# Altium schematic sheet Time Circuit Control.SchDoc
size A4; SheetNumber: 9; SheetTotal: 9
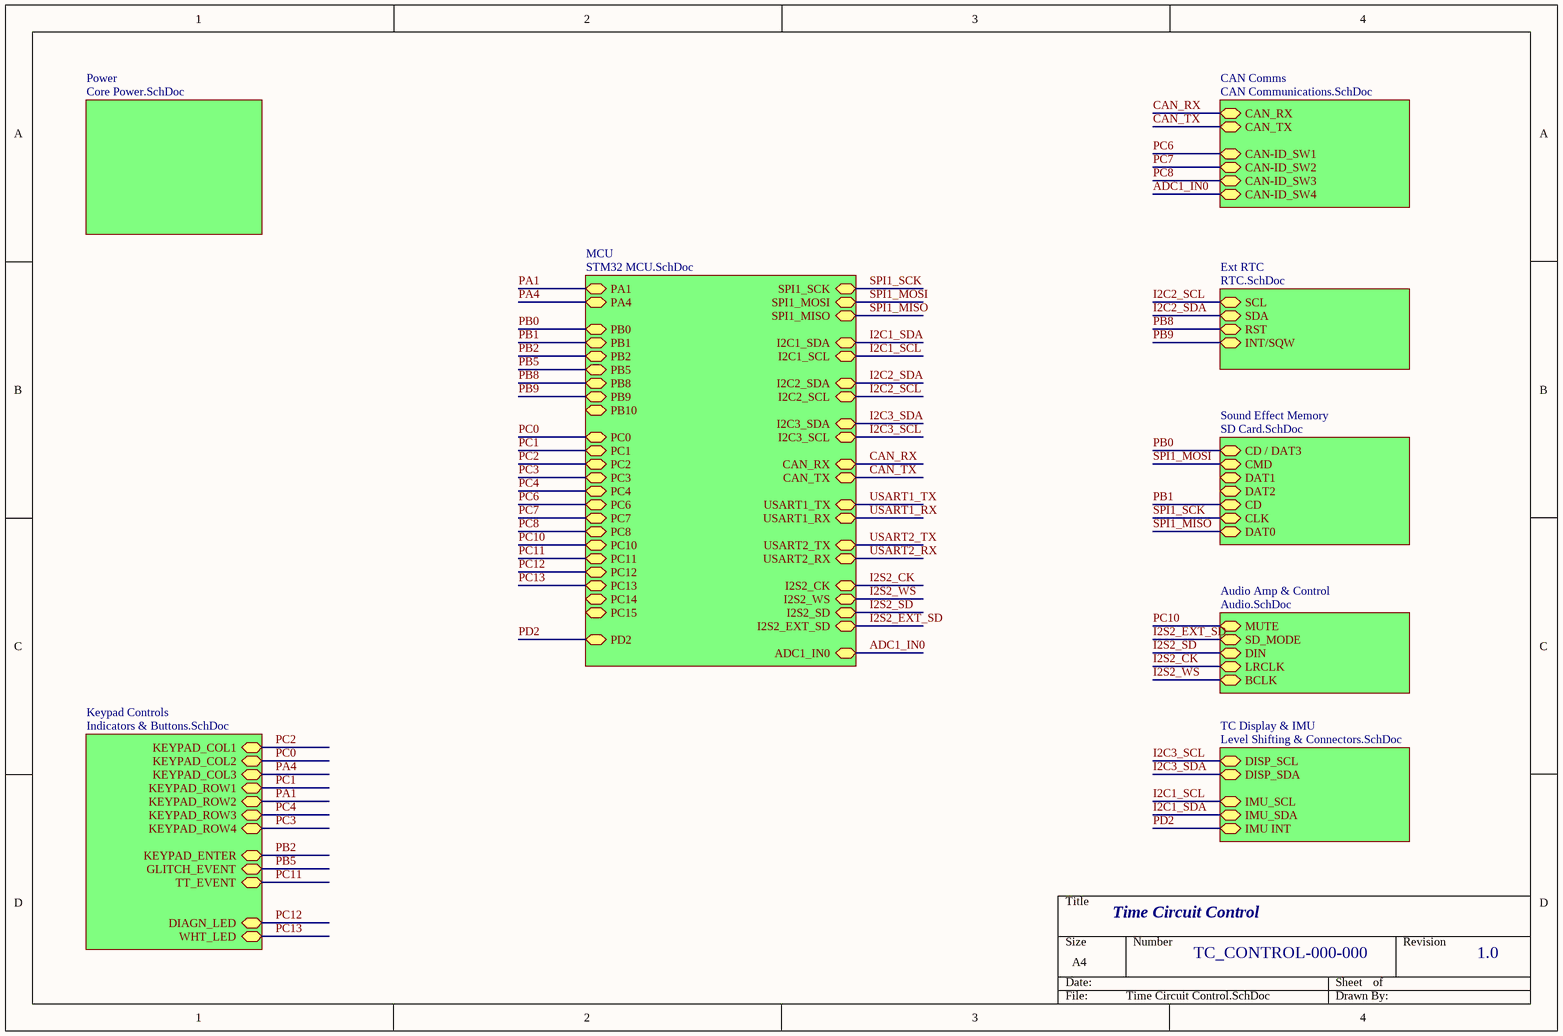
[diagram p0: Time Circuit Control.SchDoc]

## Sub-sheets
Audio Amp & Control = Audio.SchDoc: DIN, SD_MODE, LRCLK, MUTE, BCLK
CAN Comms = CAN Communications.SchDoc: CAN_RX, CAN_TX, CAN-ID_SW1, CAN-ID_SW2, CAN-ID_SW3, CAN-ID_SW4
Ext RTC = RTC.SchDoc: SDA, RST, INT/SQW, SCL
Keypad Controls = Indicators & Buttons.SchDoc: KEYPAD_COL2, KEYPAD_ENTER, KEYPAD_COL1, GLITCH_EVENT, DIAGN_LED, KEYPAD_ROW2, KEYPAD_COL3, TT_EVENT, KEYPAD_ROW1, KEYPAD_ROW4, WHT_LED, KEYPAD_ROW3
MCU = STM32 MCU.SchDoc: SPI1_SCK, SPI1_MOSI, PA1, PA4, PC12, I2S2_CK, PC4, I2S2_WS, I2S2_SD, PD2, PC15, PC1, PC0, PC14, PC13, PB9, PB8, PC11, PC10, I2S2_EXT_SD, I2C1_SDA, I2C1_SCL, PB2, PB1, I2C2_SDA, I2C2_SCL, PB10, PB0, CAN_RX, CAN_TX, USART2_TX, PC7, PC8, I2C3_SDA, USART2_RX, PC6, I2C3_SCL, USART1_TX, USART1_RX, PB5, SPI1_MISO, PC3, PC2, ADC1_IN0
Power = Core Power.SchDoc: no entries
Sound Effect Memory = SD Card.SchDoc: CD / DAT3, CMD, DAT1, DAT2, CD, CLK, DAT0
TC Display & IMU = Level Shifting & Connectors.SchDoc: IMU INT, DISP_SDA, IMU_SDA, IMU_SCL, DISP_SCL

## Nets
ADC1_IN0: sheet MCU/ADC1_IN0, sheet CAN Comms/CAN-ID_SW4
CAN_RX: sheet MCU/CAN_RX, sheet CAN Comms/CAN_RX
CAN_TX: sheet MCU/CAN_TX, sheet CAN Comms/CAN_TX
I2C1_SCL: sheet MCU/I2C1_SCL, sheet TC Display & IMU/IMU_SCL
I2C1_SDA: sheet MCU/I2C1_SDA, sheet TC Display & IMU/IMU_SDA
I2C2_SCL: sheet MCU/I2C2_SCL, sheet Ext RTC/SCL
I2C2_SDA: sheet MCU/I2C2_SDA, sheet Ext RTC/SDA
I2C3_SCL: sheet MCU/I2C3_SCL, sheet TC Display & IMU/DISP_SCL
I2C3_SDA: sheet MCU/I2C3_SDA, sheet TC Display & IMU/DISP_SDA
I2S2_CK: sheet MCU/I2S2_CK, sheet Audio Amp & Control/LRCLK
I2S2_EXT_SD: sheet MCU/I2S2_EXT_SD, sheet Audio Amp & Control/SD_MODE
I2S2_SD: sheet MCU/I2S2_SD, sheet Audio Amp & Control/DIN
I2S2_WS: sheet MCU/I2S2_WS, sheet Audio Amp & Control/BCLK
PA1: sheet MCU/PA1, sheet Keypad Controls/KEYPAD_ROW2
PA4: sheet MCU/PA4, sheet Keypad Controls/KEYPAD_COL3
PB0: sheet MCU/PB0, sheet Sound Effect Memory/CD / DAT3
PB1: sheet MCU/PB1, sheet Sound Effect Memory/CD
PB2: sheet MCU/PB2, sheet Keypad Controls/KEYPAD_ENTER
PB5: sheet MCU/PB5, sheet Keypad Controls/GLITCH_EVENT
PB8: sheet MCU/PB8, sheet Ext RTC/RST
PB9: sheet MCU/PB9, sheet Ext RTC/INT/SQW
PC0: sheet MCU/PC0, sheet Keypad Controls/KEYPAD_COL2
PC1: sheet MCU/PC1, sheet Keypad Controls/KEYPAD_ROW1
PC2: sheet MCU/PC2, sheet Keypad Controls/KEYPAD_COL1
PC3: sheet MCU/PC3, sheet Keypad Controls/KEYPAD_ROW4
PC4: sheet MCU/PC4, sheet Keypad Controls/KEYPAD_ROW3
PC6: sheet MCU/PC6, sheet CAN Comms/CAN-ID_SW1
PC7: sheet MCU/PC7, sheet CAN Comms/CAN-ID_SW2
PC8: sheet MCU/PC8, sheet CAN Comms/CAN-ID_SW3
PC10: sheet MCU/PC10, sheet Audio Amp & Control/MUTE
PC11: sheet MCU/PC11, sheet Keypad Controls/TT_EVENT
PC12: sheet MCU/PC12, sheet Keypad Controls/DIAGN_LED
PC13: sheet MCU/PC13, sheet Keypad Controls/WHT_LED
PD2: sheet MCU/PD2, sheet TC Display & IMU/IMU INT
SPI1_MISO: sheet MCU/SPI1_MISO, sheet Sound Effect Memory/DAT0
SPI1_MOSI: sheet MCU/SPI1_MOSI, sheet Sound Effect Memory/CMD
SPI1_SCK: sheet MCU/SPI1_SCK, sheet Sound Effect Memory/CLK
USART1_RX: sheet MCU/USART1_RX
USART1_TX: sheet MCU/USART1_TX
USART2_RX: sheet MCU/USART2_RX
USART2_TX: sheet MCU/USART2_TX

## Notes on the sheet
- Time Circuit Control
- TC_CONTROL-000-000
- 1.0